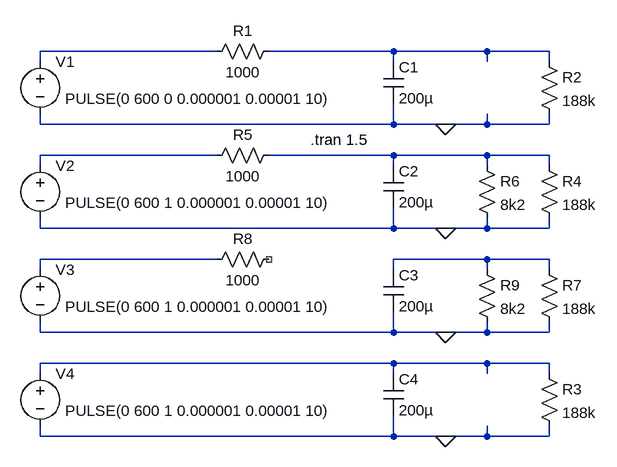
[diagram p0: schematic Precharge sim.asc]
Precharge sim.asc, the LTspice schematic file:
Version 4
SHEET 1 880 680
WIRE -256 -128 -528 -128
WIRE 16 -128 -176 -128
WIRE 160 -128 16 -128
WIRE 256 -128 160 -128
WIRE -528 -112 -528 -128
WIRE 16 -112 16 -128
WIRE 160 -112 160 -128
WIRE 256 -112 256 -128
WIRE -528 -16 -528 -32
WIRE 16 -16 16 -48
WIRE 16 -16 -528 -16
WIRE 96 -16 16 -16
WIRE 160 -16 160 -32
WIRE 160 -16 96 -16
WIRE 256 -16 256 -32
WIRE 256 -16 160 -16
WIRE -256 32 -528 32
WIRE 16 32 -176 32
WIRE 160 32 16 32
WIRE 256 32 160 32
WIRE -528 48 -528 32
WIRE 16 48 16 32
WIRE 160 48 160 32
WIRE 256 48 256 32
WIRE -528 144 -528 128
WIRE 16 144 16 112
WIRE 16 144 -528 144
WIRE 96 144 16 144
WIRE 160 144 160 128
WIRE 160 144 96 144
WIRE 256 144 256 128
WIRE 256 144 160 144
WIRE -256 192 -528 192
WIRE 160 192 16 192
WIRE 256 192 160 192
WIRE -528 208 -528 192
WIRE 16 208 16 192
WIRE 160 208 160 192
WIRE 256 208 256 192
WIRE -528 304 -528 288
WIRE 16 304 16 272
WIRE 16 304 -528 304
WIRE 96 304 16 304
WIRE 160 304 160 288
WIRE 160 304 96 304
WIRE 256 304 256 288
WIRE 256 304 160 304
WIRE 16 352 -528 352
WIRE 160 352 16 352
WIRE 256 352 160 352
WIRE -528 368 -528 352
WIRE 16 368 16 352
WIRE 160 368 160 352
WIRE 256 368 256 352
WIRE -528 464 -528 448
WIRE 16 464 16 432
WIRE 16 464 -528 464
WIRE 96 464 16 464
WIRE 160 464 160 448
WIRE 160 464 96 464
WIRE 256 464 256 448
WIRE 256 464 160 464
FLAG 96 -16 0
FLAG 96 144 0
FLAG 96 304 0
FLAG 96 464 0
SYMBOL cap 0 -112 R0
SYMATTR InstName C1
SYMATTR Value 200µ
SYMBOL res 240 -128 R0
SYMATTR InstName R2
SYMATTR Value 188k
SYMBOL voltage -528 -128 R0
WINDOW 3 38 73 Left 2
WINDOW 123 0 0 Left 0
WINDOW 39 0 0 Left 0
SYMATTR Value PULSE(0 600 0 0.000001 0.00001 10)
SYMATTR InstName V1
SYMBOL res -160 -144 R90
WINDOW 0 0 56 VBottom 2
WINDOW 3 32 56 VTop 2
SYMATTR InstName R1
SYMATTR Value 1000
SYMBOL cap 0 48 R0
SYMATTR InstName C2
SYMATTR Value 200µ
SYMBOL res 240 32 R0
SYMATTR InstName R4
SYMATTR Value 188k
SYMBOL voltage -528 32 R0
WINDOW 3 38 73 Left 2
WINDOW 123 0 0 Left 0
WINDOW 39 0 0 Left 0
SYMATTR Value PULSE(0 600 1 0.000001 0.00001 10)
SYMATTR InstName V2
SYMBOL res -160 16 R90
WINDOW 0 0 56 VBottom 2
WINDOW 3 32 56 VTop 2
SYMATTR InstName R5
SYMATTR Value 1000
SYMBOL res 144 32 R0
SYMATTR InstName R6
SYMATTR Value 8k2
SYMBOL cap 0 208 R0
SYMATTR InstName C3
SYMATTR Value 200µ
SYMBOL res 240 192 R0
SYMATTR InstName R7
SYMATTR Value 188k
SYMBOL voltage -528 192 R0
WINDOW 3 38 73 Left 2
WINDOW 123 0 0 Left 0
WINDOW 39 0 0 Left 0
SYMATTR Value PULSE(0 600 1 0.000001 0.00001 10)
SYMATTR InstName V3
SYMBOL res -160 176 R90
WINDOW 0 0 56 VBottom 2
WINDOW 3 32 56 VTop 2
SYMATTR InstName R8
SYMATTR Value 1000
SYMBOL res 144 192 R0
SYMATTR InstName R9
SYMATTR Value 8k2
SYMBOL cap 0 368 R0
SYMATTR InstName C4
SYMATTR Value 200µ
SYMBOL res 240 352 R0
SYMATTR InstName R3
SYMATTR Value 188k
SYMBOL voltage -528 352 R0
WINDOW 3 38 73 Left 2
WINDOW 123 0 0 Left 0
WINDOW 39 0 0 Left 0
SYMATTR Value PULSE(0 600 1 0.000001 0.00001 10)
SYMATTR InstName V4
TEXT -112 8 Left 2 !.tran 1.5

The netlist it stands for:
* Precharge sim.asc
C1 N002 0 200µ
R2 N002 0 188k
V1 N001 0 PULSE(0 600 0 0.000001 0.00001 10)
R1 N002 N001 1000
C2 N004 0 200µ
R4 N004 0 188k
V2 N003 0 PULSE(0 600 1 0.000001 0.00001 10)
R5 N004 N003 1000
R6 N004 0 8k2
C3 N006 0 200µ
R7 N006 0 188k
V3 N005 0 PULSE(0 600 1 0.000001 0.00001 10)
R8 NC_01 N005 1000
R9 N006 0 8k2
C4 N007 0 200µ
R3 N007 0 188k
V4 N007 0 PULSE(0 600 1 0.000001 0.00001 10)
.tran 1.5
.backanno
.end